# EasyEDA Pro project SCH_and_PCB.epro, board 主板4.0
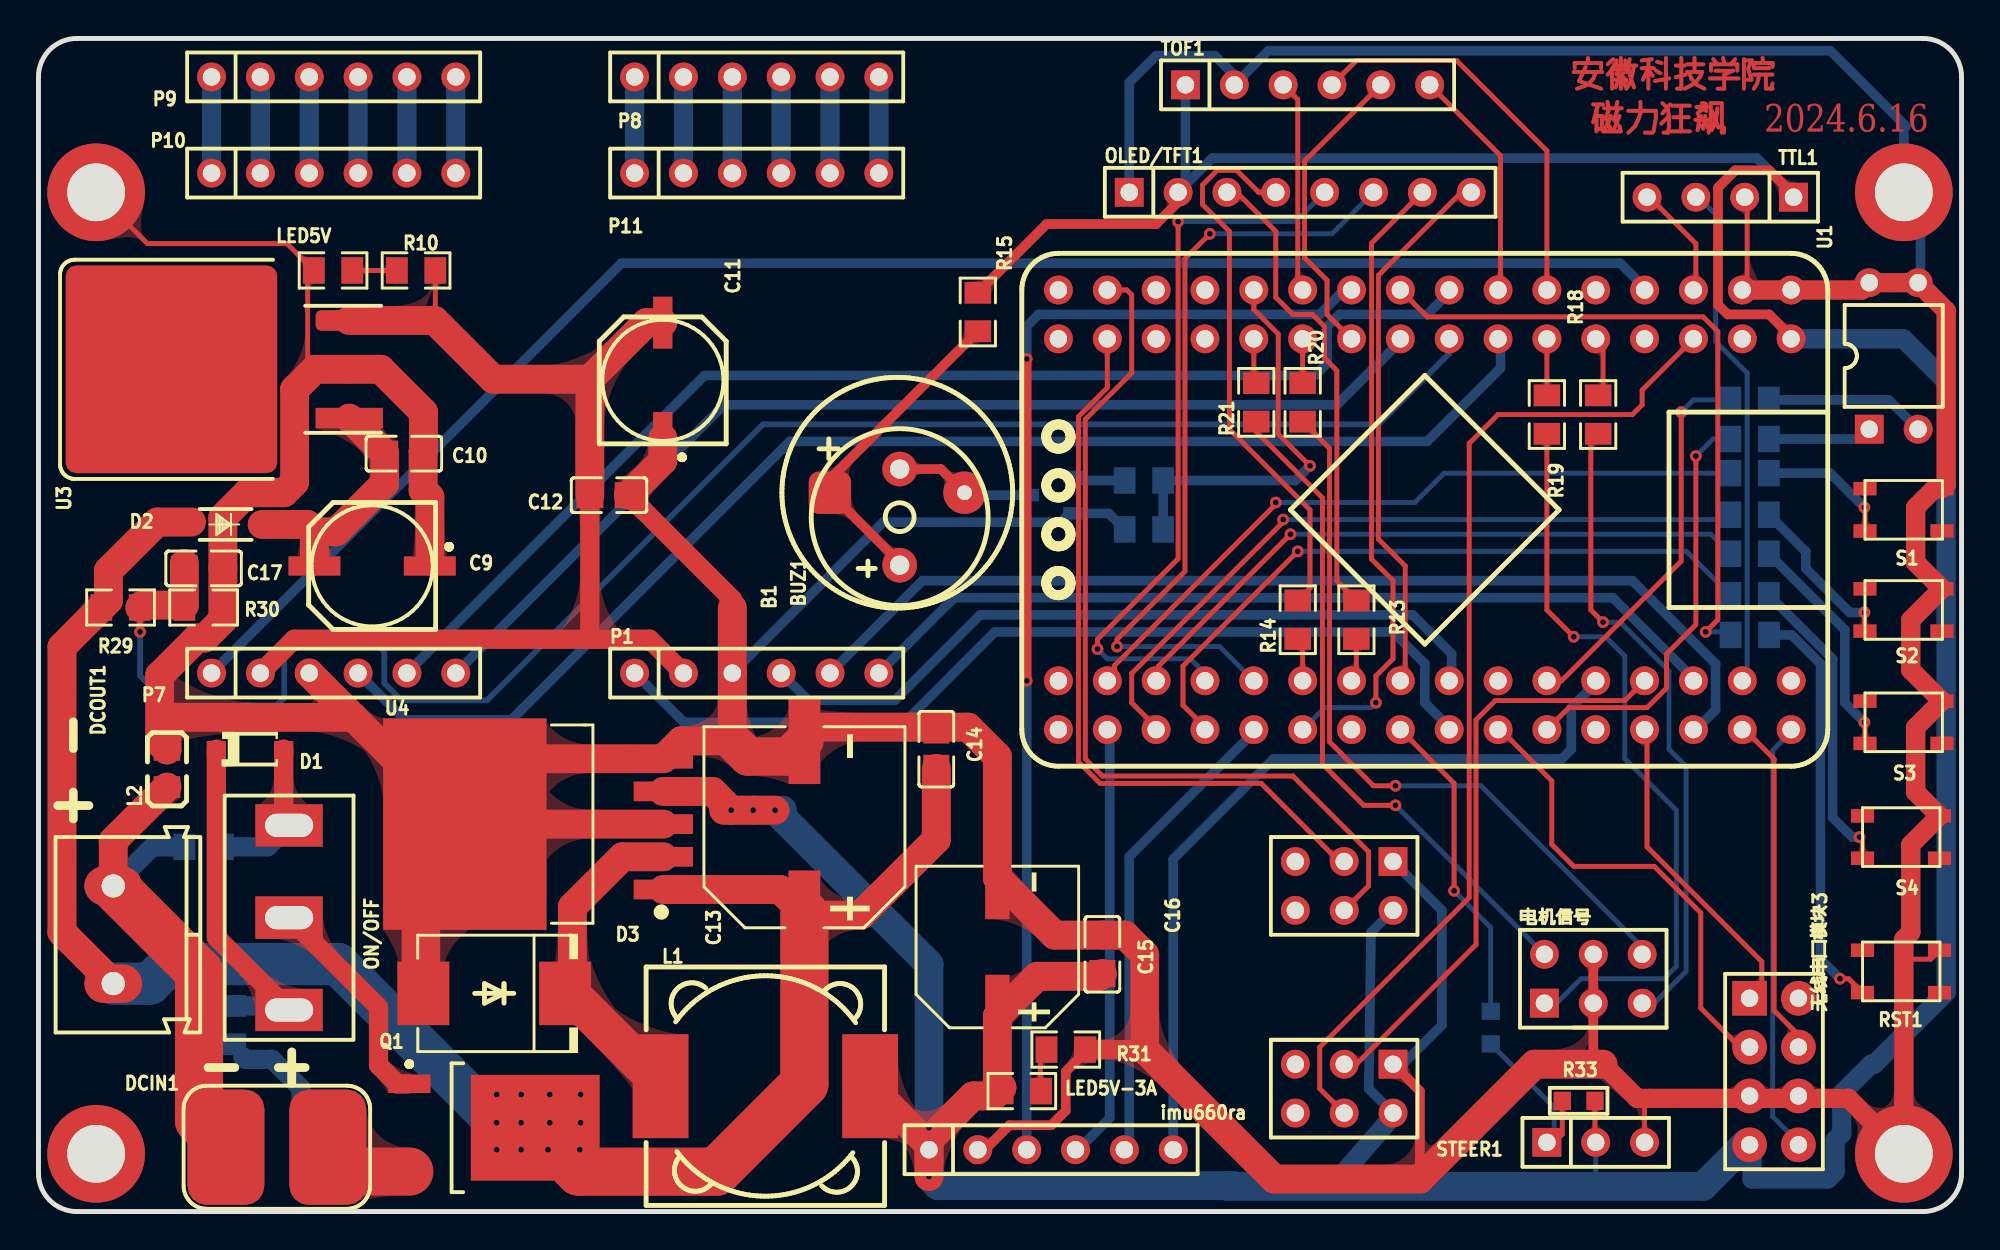
[diagram p10: board, top side]
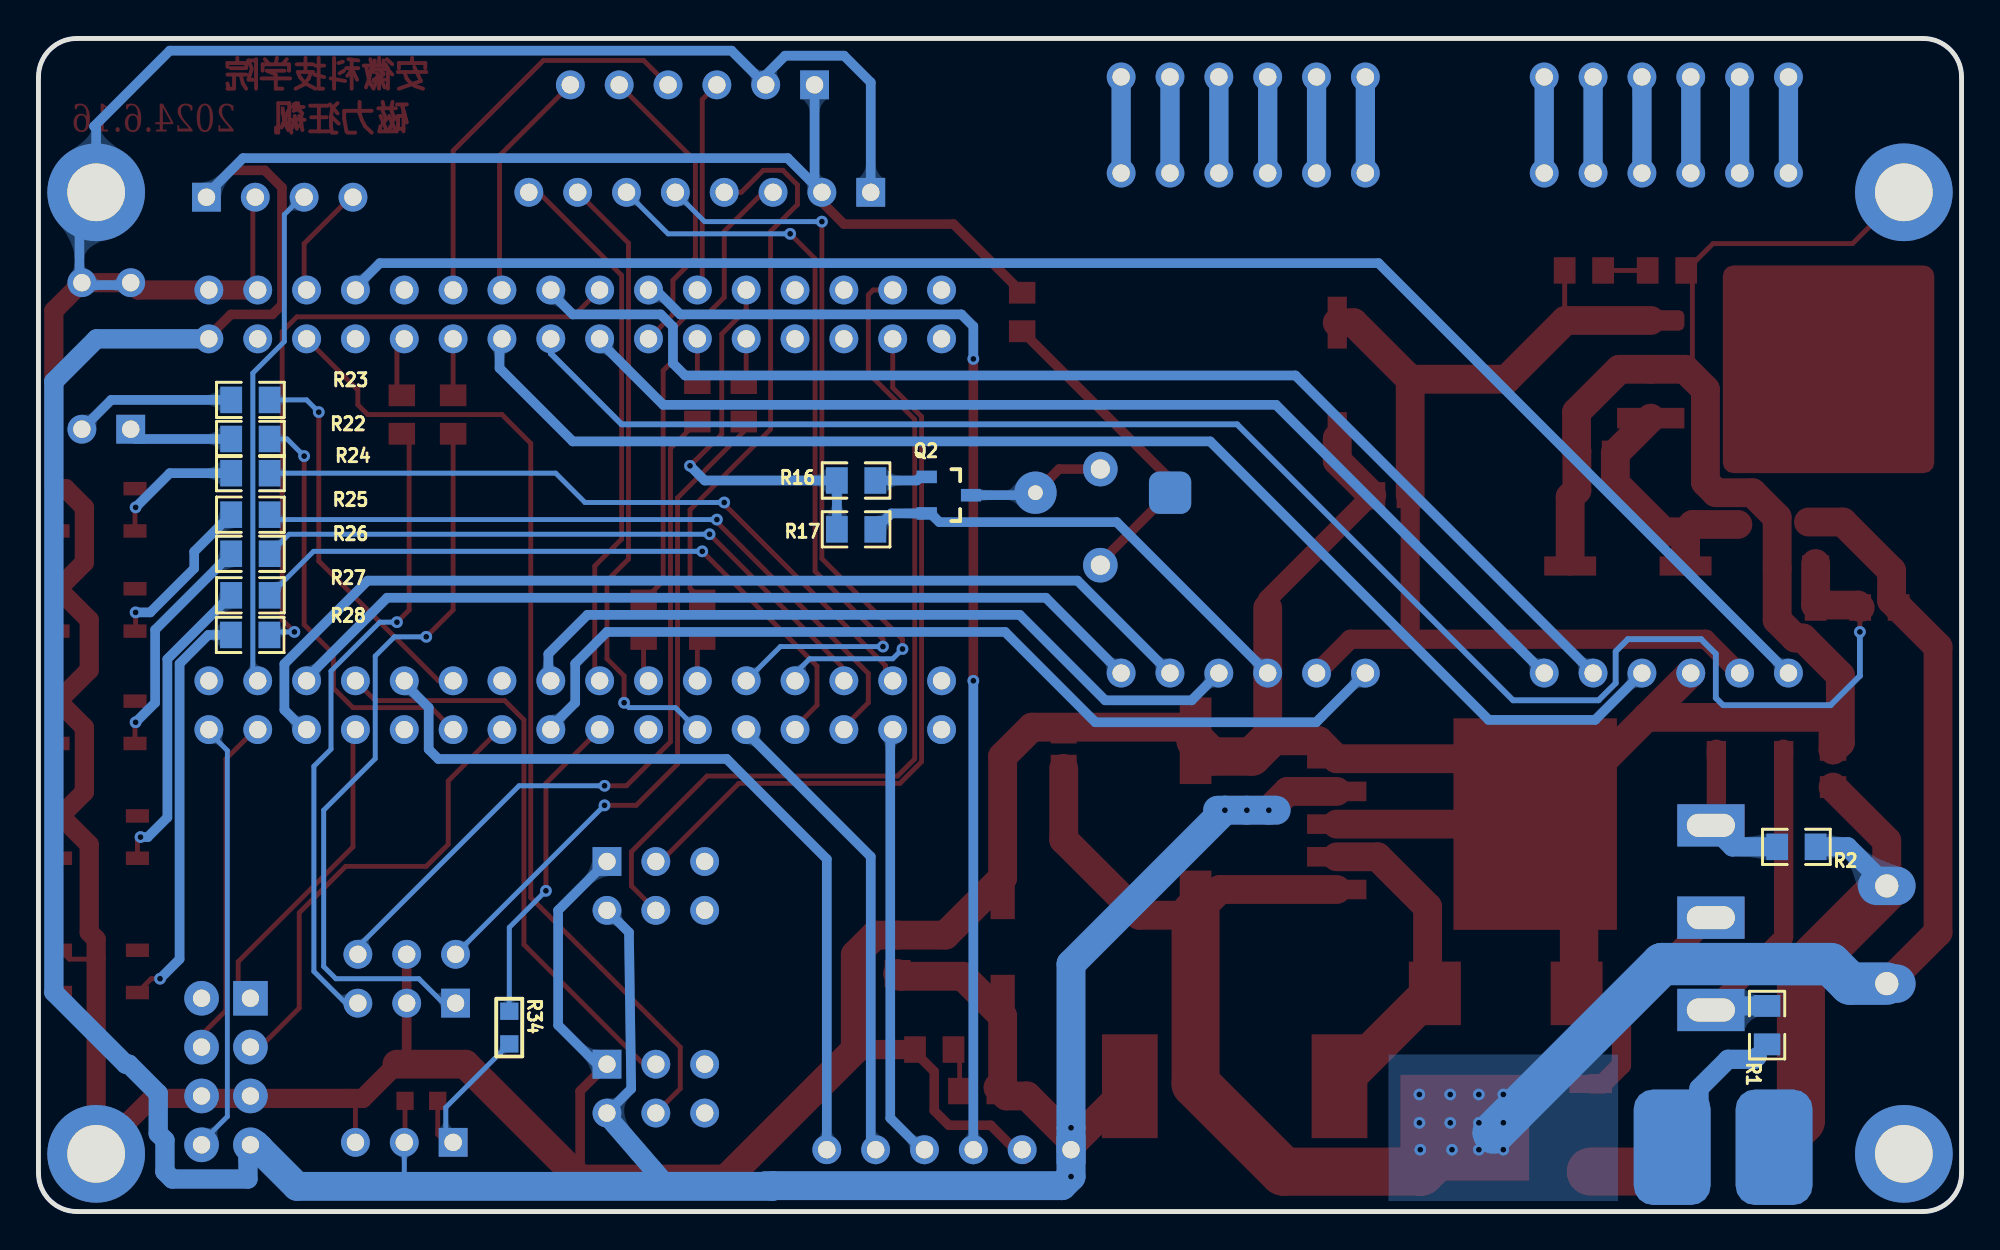
[diagram p11: board, bottom side, seen from below]

Outline 100 x 61 mm; copper layers: Top Layer, Bottom Layer. Coordinates in mm from the lower left corner of the outline.
Outline path: 0,59 0,2 arc(0.59,0.59) 2,0 98,0 arc(99.41,0.59) 100,2 100,59 arc(99.41,60.41) 98,61 2,61 arc(0.59,60.41) 0,59
Stack: Top Layer 0.035mm / Dielectric1 1.51mm FR4 er 4.5 / Bottom Layer 0.035mm

## Design rules (mm)
template: JLCPCB Capability(Two Layers Board)
spacing copperThickness1oz (default): track to track 0.102, other pairs 0.152 to 0.3
spacing copperThickness2oz: track to track 0.203, other pairs 0.152 to 0.3
track width copperThickness1oz (default): min 0.127, default 0.254, max 2.54
track width copperThickness2oz: min 0.203, default 0.254, max 2.54
differential pair differentialPair (default): width min 0.127, default 0.254, max 2.54; gap min 0.152, default 0.152
via viaSize (default): diameter min 0.5, default 0.61, max 10; hole min 0.3, default 0.305, max 6.3

## Placement (name value [footprint] x y rotation side)
B1  BEEP  [蜂鸣器-直插-无源蜂鸣器]  44.66 37.38 90 top
BUZ1  蜂鸣器  [BUZ-TH_BD9.0-P5.00-D0.6-FD]  44.78 36.11 90 top
C9  100uF  [CAPS6.3]  17.35 33.57 0 top
C10  100nF  [C0805]  19 39.41 0 top
C11  220uF  [CAPS6.3]  32.46 43.22 270 top
C12  100nF  [C0805]  29.67 37.25 0 top
C13  680uF  [CAP-SMD_BD10.0-L10.3-W10.3-LS10.9-FD]  39.83 19.98 90 top
C14  100nF  [C0805]  46.69 24.04 90 top
C15  100nF  [C0805]  55.32 13.38 90 top
C16  330uF  [CAP-SMD_BD8.0-L8.3-W8.3-LS9.9-FD]  49.86 13.76 90 top
C17  100nF  [C0805]  8.59 33.44 0 top
D1  BZT52C16  [SOD-123-L]  11 24.04 180 top
D2  SS54  [SOD-123]  9.73 35.73 0 top
D3  1N5823  [DO-214AB_L6.9-W5.9-LS7.9-RD]  23.7 11.34 180 top
DCIN1  T型插头  [WIRED T-HEADER THROUGHHOLE]  12.4 3.34 270 top
DCOUT1  DCOUT1  [KF/WJ/DG 301-2P-5.0MM]  3.89 14.39 270 top
imu660ra  Header 6  [HDR1X6]  46.31 3.22 0 top
L1  33uH  [IND-SMD_L12.3-W12.3]  37.8 6.52 0 top
L2  0  [L0805]  6.68 23.04 90 top
LED5V  GREEN  [LED0805]  15.32 48.94 180 top
LED5V-3A  GREEN  [LED0805]  51.13 6.26 0 top
NOREF  -  [Pad_e1]  3 3 0 top
NOREF#2  -  [Pad_e0]  3 53 0 top
NOREF#3  -  [Pad_e3]  97 3 0 top
NOREF#4  -  [Pad_e4]  97 53 0 top
OLED/TFT1  Header 8  [HDR1X8]  56.72 53 0 top
ON/OFF  SW-SPDT  [SS12D10]  13.03 15.28 90 top
P1  Header-D-M 1x6P  [HDR1X6-M]  31 28 0 top
P7  Header-D-M 1x6P  [HDR1X6-M]  9 28 0 top
P8  Header-D-M 1x6P  [HDR1X6-M]  31 59 0 top
P9  Header-D-M 1x6P  [HDR1X6-M]  9 59 0 top
P10  Header-D-M 1x6P  [HDR1X6-M]  9 54 0 top
P11  Header-D-M 1x6P  [HDR1X6-M]  31 54 0 top
Q1  HY19P03  [TO-252AA]  22.56 4.36 0 top
Q2  S8050  [SOT-23]  52.66 37.25 180 bottom
R1  4.7K  [R0805]  10.11 9.69 90 bottom
R2  1K  [R0805]  8.59 18.96 0 bottom
R10  4.7K  [R0805]  19.64 48.94 180 top
R13  100R  [R0805]  68.53 30.78 90 top
R14  100R  [R0805]  65.48 30.78 90 top
R15  10R  [R0805]  48.85 46.78 270 top
R16  4.7K  [R0805]  57.48 38.01 180 bottom
R17  10K  [R0805]  57.48 35.47 180 bottom
R18  100R  [R0805]  81.1 41.44 270 top
R19  100R  [R0805]  78.44 41.44 90 top
R20  100R  [R0805]  65.74 42.08 270 top
R21  100R  [R0805]  63.32 42.08 90 top
R22  470R  [R0805]  88.98 40.17 0 bottom
R23  470R  [R0805]  88.98 42.2 0 bottom
R24  470R  [R0805]  88.98 38.39 0 bottom
R25  470R  [R0805]  88.98 36.24 0 bottom
R26  470R  [R0805]  88.98 34.2 0 bottom
R27  470R  [R0805]  88.98 32.05 0 bottom
R28  470R  [R0805]  88.99 29.98 0 bottom
R29  200k  [R0805]  4.27 31.41 180 top
R30  20k  [R0805]  8.59 31.41 180 top
R31  4.7K  [R0805]  53.42 8.42 180 top
R33  10K  [RESC1608[0603]S-N]  80.09 5.76 0 top
R34  100R  [RESC1608[0603]S-N]  75.52 9.57 270 bottom
RST1  Button  [PTS810-3*4-CURVEPIN]  96.85 12.49 180 top
S1  Button  [PTS810-3*4-CURVEPIN]  96.98 36.49 180 top
S2  Button  [PTS810-3*4-CURVEPIN]  96.98 31.28 180 top
S3  Button  [PTS810-3*4-CURVEPIN]  96.98 25.44 180 top
S4  Button  [PTS810-3*4-CURVEPIN]  96.85 19.47 180 top
S5  SW DIP-2  [DIP4]  96.47 44.49 0 top
STEER1  Header 3  [HDR1X3]  78.44 3.6 0 top
TOF1  Header 6  [HDR1X6]  59.64 58.59 0 top
TTL1  Header 4  [HDR1X4]  91.26 52.75 180 top
U1  STC16F40K128_CoreBoard  [STC16F40K128_COREBOARD]  72.09 36.49 270 top
U3  SPX2940-5.0  [TO-263-3]  11.54 43.8 90 top
U4  LM2596S-5.0  [TO-263-5_L10.2-W8.9-P1.70-BR]  27.33 20.15 0 top
无线串口模块3  Header 4X2  [HDR4X2_A1]  88.98 11.09 270 top
电机信号  电机信号  [HDR2X3]  78.31 10.84 0 top
编码器1  编码器L  [HDR2X3]  70.44 18.2 180 top
编码器2  编码器R  [HDR2X3]  70.44 7.66 180 top

## Footprints (pads in the part's own frame, mm; a bottom-side part is the same pattern mirrored in y, then rotated)
BUZ-TH_BD9.0-P5.00-D0.6-FD
  round 1.8 hole 1: 1(-2.5,0) 2(2.5,0)
C0805
  rect 1.41x1.35 smd: 1(-1,0) 2(1,0)
CAP-SMD_BD8.0-L8.3-W8.3-LS9.9-FD
  rect 4.3x1.26 smd: 1(-3.596,0) 2(3.596,0)
CAP-SMD_BD10.0-L10.3-W10.3-LS10.9-FD
  rect 4.5x1.65 smd: 1(-4.5,0) 2(4.5,0)
CAPS6.3
  rect 2.7x1 smd: 1(-3,0) 2(3,0)
DIP4
  rect 1.5x1.5 hole 0.9x0.905: 1(-1.27,-3.81)
  round 1.5 hole 0.9x0.905: 2(1.27,-3.81) 3(1.27,3.81) 4(-1.27,3.81)
DO-214AB_L6.9-W5.9-LS7.9-RD
  rect 2.7x3.3 smd: 1(-3.687,0) 2(3.687,0)
HDR1X3
  rect 1.5x1.5 hole 0.905x0.9: 1(0,0)
  round 1.5 hole 0.905x0.9: 2(2.54,0) 3(5.08,0)
HDR1X4
  rect 1.5x1.5 hole 0.905x0.9: 1(0,0)
  round 1.5 hole 0.905x0.9: 2(2.54,0) 3(5.08,0) 4(7.62,0)
HDR1X6
  rect 1.5x1.5 hole 0.905x0.9: 1(0,0)
  round 1.5 hole 0.905x0.9: 2(2.54,0) 3(5.08,0) 4(7.62,0) 5(10.16,0) 6(12.7,0)
HDR1X6-M
  round 1.5 hole 0.905x0.9: 1(0,0) 2(2.54,0) 3(5.08,0) 4(7.62,0) 5(10.16,0) 6(12.7,0)
HDR1X8
  rect 1.5x1.5 hole 0.905x0.9: 1(0,0)
  round 1.5 hole 0.905x0.9: 2(2.54,0) 3(5.08,0) 4(7.62,0) 5(10.16,0) 6(12.7,0) 7(15.24,0) 8(17.78,0)
HDR2X3
  rect 1.5x1.5 hole 0.9: 1(0,0)
  round 1.5 hole 0.9: 2(0,2.54) 3(2.54,0) 4(2.54,2.54) 5(5.08,0) 6(5.08,2.54)
HDR4X2_A1
  rect 1.8x1.8 hole 0.9: 1(0,0)
  round 1.8 hole 0.9: 2(0,2.54) 3(2.54,0) 4(2.54,2.54) 5(5.08,0) 6(5.08,2.54) 7(7.62,0)
  round 1.8 hole 0.905x0.9: 8(7.62,2.54)
IND-SMD_L12.3-W12.3
  rect 2.9x5.4 smd: 1(-5.45,0) 2(5.45,0)
KF/WJ/DG 301-2P-5.0MM
  oval 2x3 hole 1.2x1.205: 1(2.54,0) 2(-2.54,0)
L0805
  rect 1.133x1.377 smd: 1(-0.966,0) 2(0.966,0)
LED0805
  rect 1.133x1.377 smd: A(-1,0) C(1,0)
Pad_e0
  round 5.08 hole 3: 1(0,0)
Pad_e1
  round 5.08 hole 3: 1(0,0)
Pad_e3
  round 5.08 hole 3: 1(0,0)
Pad_e4
  round 5.08 hole 3: 1(0,0)
PTS810-3*4-CURVEPIN
  rect 1.2x0.7 smd: 1(-2,-1.1) 2(2,1.1) 3(2,-1.1) 4(-2,1.1)
R0805
  rect 1.133x1.377 smd: 1(-1,0) 2(1,0)
RESC1608[0603]S-N
  rect 0.9x0.95 smd: 1(-0.85,0) 2(0.85,0)
SOD-123
  rect 1.2x0.85 smd: A(-1.9,0) K(1.9,0)
SOD-123-L
  rect 1x0.85 smd: A(-1.75,0) K(1.75,0)
SOT-23
  rect 1.05x0.65 smd: 1(-1.15,0.95) 2(-1.15,-0.95) 3(1.15,0)
SS12D10
  rect 2.2x3.5 hole 1.2x2.5: 1(-4.8,0) 2(0,0) 3(4.8,0)
STC16F40K128_COREBOARD
  round 1.5 hole 0.9: 1(-11.43,19.05) 2(-8.89,19.05) 3(-11.43,16.51) 5(-11.43,13.97) 6(-8.89,13.97) 8(-8.89,11.43) 10(-8.89,8.89) 12(-8.89,6.35) 17(-11.43,-1.27) 19(-11.43,-3.81) 22(-8.89,-6.35) 24(-8.89,-8.89) 27(-11.43,-13.97) 29(-11.43,-16.51) 30(-8.89,-16.51) 35(8.89,-16.51) 36(11.43,-16.51) 37(8.89,-13.97) 38(11.43,-13.97) 39(8.89,-11.43) 40(11.43,-11.43) 41(8.89,-8.89) 42(11.43,-8.89) 43(8.89,-6.35) 44(11.43,-6.35) 45(8.89,-3.81) 47(8.89,-1.27) 48(11.43,-1.27) 49(8.89,1.27) 50(11.43,1.27) 51(8.89,3.81) 52(11.43,3.81) 53(8.89,6.35) 54(11.43,6.35) 55(8.89,8.89) 56(11.43,8.89) 57(8.89,11.43) 58(11.43,11.43) 59(8.89,13.97) 60(11.43,13.97) 61(8.89,16.51) 62(11.43,16.51)
  round 1.5 hole 0.905x0.9: 4(-8.89,16.51) 7(-11.43,11.43) 9(-11.43,8.89) 11(-11.43,6.35) 13(-11.43,3.81) 14(-8.89,3.81) 15(-11.43,1.27) 16(-8.89,1.27) 18(-8.89,-1.27) 20(-8.89,-3.81) 21(-11.43,-6.35) 23(-11.43,-8.89) 25(-11.43,-11.43) 26(-8.89,-11.43) 28(-8.89,-13.97) 31(-11.43,-19.05) 32(-8.89,-19.05) 33(8.89,-19.05) 34(11.43,-19.05) 46(11.43,-3.81) 63(8.89,19.05) 64(11.43,19.05)
TO-252AA
  rect 6.7x5.5 smd: 1(3.275,0)
  rect 2.2x0.95 smd: 2(-3.275,2.28) 3(-3.275,-2.28)
TO-263-3
  rect 1.07x3.5 smd: 1(-2.54,-4.623)
  custom 1.07x3.5 smd: 2(0,-4.623) 3(2.54,-4.623)
  custom 10.8x11 smd: 4(0,4.623)
TO-263-5_L10.2-W8.9-P1.70-BR
  rect 3.083x1.02 smd: 1(5.16,-3.4) 2(5.16,-1.7) 3(5.16,0) 4(5.16,1.7) 5(5.16,3.4)
  rect 8.5x11 smd: 6(-5.16,0)
WIRED T-HEADER THROUGHHOLE
  custom 6x4 hole 2.605x2.6: 1(0,2.65) 2(0,-2.65)
蜂鸣器-直插-无源蜂鸣器
  custom 2.2x2.2 hole 0.767x0.762: 1(0,3.5)
  round 2.2 hole 0.767x0.762: 2(0,-3.5)

## Nets
As in the schematic, except:
GND: C9.2 C10.2 C11.2 C12.2 C13.2 C14.2 C15.2 C16.2 C17.2 D3.2 imu660ra.2 L2.2 LED5V.C NOREF#2.1 NOREF#3.1 NOREF#4.1 OLED/TFT1.1 P1.3 P7.3 Q2.2 R17.2 R30.1 R31.1 RST1.1 S1.1 S2.1 S3.1 S4.1 S5.3 S5.4 STEER1.3 TOF1.2 TTL1.2 U1.1 U1.3 U3.2 U4.3 U4.5 U4.6 无线串口模块3.5 无线串口模块3.6 电机信号.3 电机信号.4 编码器1.1 编码器2.1

Pads without a net: NOREF 1; RST1 3 4; S1 3 4; S2 3 4; S3 3 4; S4 3 4; U1 4 8 9 25 26 27 28 31 32 33 34 46 51 63; U3 4; 无线串口模块3 2; 编码器1 5 6; 编码器2 5 6

## Via types
v1: diameter 0.61, hole 0.305, Top Layer to Bottom Layer, 43 vias

## Routing (per net, layer and track width the routed paths; a pad name or vN(x,y) marks a point on that pad's centre or on a via; arc(x,y) is an arc through that point)
+5V: length 250.3
  Top Layer w0.254: 80.94,6.01 80.94,4.02 81.36,3.6
  Top Layer w0.5: 91.39,52.75 90,54.14 88.23,54.14 87.34,53.25 87.34,47.15 87.84,46.65 90,46.65 91.26,45.38 ; R15.1 52.42,51.35 58.12,51.35 59.26,52.49 OLED/TFT1.2
  Top Layer w1.5: L1.2 46.31,3.46 ; 46.31,3.46 v1(46.31,1.82) ; 46.31,3.46 46.31,3.72 48.59,6.01 49.66,6.01 50.1,6.45 49.86,6.68 C16.1 51.94,12.23 55.18,12.23 C15.1 ; v1(36.02,20.87) v1(37.16,20.87) v1(38.31,20.87) ; v1(36.02,20.87) 35.64,20.87 ; v1(36.02,20.87) 35.04,21.85 U4.4
  Bottom Layer w0.254: STEER1.2 80.98,1.56
  Bottom Layer w0.5: 91.39,52.75 89.36,54.78 61.04,54.78 59.64,53.38 ; 编码器1.2 69.29,14.52 69.18,6.38 编码器2.2 ; 59.64,53.38 OLED/TFT1.2 ; 59.64,53.38 TOF1.1
  Bottom Layer w1: 62.18,1.35 67.3,1.35 70.56,5.12 ; 88.34,3.47 89.11,2.71 89.11,1.69 93.04,1.69 93.42,2.07 93.42,3.71 93.77,4.06 93.77,6.14 95.3,7.66 95.46,7.66 99.2,11.41 99.2,43.16 96.98,45.38 91.26,45.38
  Bottom Layer w1.5: v1(38.31,20.87) 38.69,20.87 ; v1(38.31,20.87) v1(37.16,20.87) v1(36.02,20.87) 35.64,20.87 ; v1(38.31,20.87) 46.31,12.87 v1(46.31,4.35) imu660ra.1 v1(46.31,1.82) 46.78,1.35 61.8,1.35 ; 61.8,1.35 61.84,1.31 86.56,1.31 88.72,3.47 无线串口模块3.7 ; 61.8,1.35 62.18,1.35
GND: length 409.3
  Top Layer w0.254: 83.82,5.88 83.52,5.58 83.52,3.98 83.9,3.6 ; 96.73,13.12 98.39,13.12 98.85,13.59 ; NOREF#2.1 5.67,50.33 12.92,50.33 LED5V.C 14,48.61 14,43.42 ; 88.72,47.92 88.85,48.05 88.85,52.75
  Top Layer w0.5: R31.1 54.42,8.28 53.42,7.28 53.42,5.25 52.66,4.49 50.48,4.49 48.7,2.71 ; 71.83,1.44 71.83,6.26 编码器2.1 ; 80.85,13.76 电机信号.3 80.85,8.17 81.36,7.66
  Top Layer w1: 88.72,47.92 94.82,47.92 S5.4 S5.3 ; 81.36,7.66 83.14,5.88 94.12,5.88 NOREF#3.1 97,14.16 97.36,14.52 97.36,19.08 S4.1 97.62,21.81 97.62,25.18 S3.1 97.36,28.16 97.36,30.76 S2.1 97.62,33.75 97.62,36.62 98.59,37.59 S1.1 99.2,37.81 99.2,46.84 97.87,48.17 ; 36.08,31.39 36.08,31.84 C12.2 ; R31.1 57.52,8.42
  Top Layer w1.5: U4.3 U4.6 21.93,20.15 16.39,25.69 ; P7.3 16.39,25.69 ; 16.39,25.69 6.68,25.69 L2.2 6.3,24.38 6.3,27.88 8.25,29.82 8.65,29.82 9.59,30.76 C17.2 9.59,36.09 10.87,37.38 12.76,37.38 13.32,37.93 13.32,42.74 14.37,43.8 U3.2 17.79,43.8 20.02,41.57 20.02,39.55 20,39.54 20,37.51 20.35,37.16 20.35,33.82 ; 36.08,31.39 P1.3 36.08,24.48 33.43,24.48 U4.5 23.03,23.55 22.17,22.69 ; C12.2 32.46,39.05 C11.2 ; 81.36,7.66 77.8,7.66 71.83,1.69 64.25,1.69 57.52,8.42 57.52,13.35 56.5,14.38 C15.2 52.84,14.38 C16.2 49.86,23.66 48.34,25.19 40.54,25.19 C13.2
  Top Layer w2: C13.2 39.01,23.66 36.9,23.66 36.08,24.48 ; 19.89,11.72 19.89,17.86 U4.6
  Bottom Layer w0.5: 编码器1.1 72.98,15.66 72.98,9.69 70.94,7.66 编码器2.1 ; P1.3 43.93,35.85 53.16,35.85 53.61,36.3 Q2.2 55.66,36.3 R17.2 ; OLED/TFT1.1 56.72,58.72 58.11,60.1 61.17,60.1 62.18,59.1 TOF1.2 63.96,60.37 93.17,60.37 97.11,56.43 97,56.32 NOREF#4.1 97.87,52.13 97.87,48.17 95.33,48.17
GND_BAT: length 26.9
  Top Layer w1.5: DCOUT1.2 3.89,19.28 L2.1
  Top Layer w2.5: DCIN1.2 8.35,4.74 8.35,12.47 DCOUT1.2
  Bottom Layer w1: DCOUT1.2 5.92,18.96 R2.1
VCC_5V: length 57.9
  Top Layer w0.254: R10.1 20.64,46.9
  Top Layer w1: P1.2 31.78,29.76 28.94,29.76 ; 28.94,29.76 13.3,29.76 P7.2 ; 28.94,29.76 28.67,30.02 C12.1
  Top Layer w1.5: U3.3 20.6,46.34 23.66,43.28 28.67,43.28 ; 28.67,43.28 C12.1 ; 28.67,43.28 31.61,46.22 C11.1
VCC_BAT: length 99.2
  Top Layer w1.5: 7.96,35.86 6.17,35.86 3.64,33.32 3.64,31.78 R29.2 1.22,29.36 1.22,14.52 DCOUT1.1 ; U4.1 38.56,16.75 C13.1 39.9,15.41 42.75,15.41 46.69,19.34 C14.1
  Top Layer w2.5: 25.83,4.36 28.12,2.07 35.26,2.07 39.83,6.64 C13.1
  Bottom Layer w2.2: 24.34,4.1 v1(23.83,4.62) 15.57,12.87 6.81,12.87 5.79,11.85 DCOUT1.1
  vias: v1(23.83,6.09) v1(23.83,3.22) v1(25.1,6.09) v1(25.1,4.61) v1(25.1,3.22) v1(26.5,3.22) v1(26.59,6.09) v1(26.59,4.61) v1(28.15,3.22) v1(28.19,6.09) v1(28.19,4.61)
0.0: length 48.8
  Bottom Layer w0.5: 73.49,25.06 72.09,26.46 72.09,28.49 70.44,30.14 49.74,30.14 45.04,25.44 33.56,25.44 P1.1
0.1: length 39.5
  Bottom Layer w0.5: P1.4 40.04,26.58 44.53,26.58 48.97,31.03 71.45,31.03 73.49,29 73.49,27.6
0.2: length 25.3
  Top Layer w0.254: 76.03,25.06 78.69,22.39 78.69,19.09 79.84,17.95 84.03,17.95 86.44,15.53 86.44,10.58 88.47,8.55 89.61,8.55
0.3: length 16.4
  Top Layer w0.254: 89.61,11.09 89.61,13 83.65,18.96 83.65,25.06
0.4: length 30.3
  Top Layer w0.254: U1.57 82.49,26.57 75.76,26.57 74.75,25.57 74.75,13.88 68.41,7.53
0.5: length 53.7
  Bottom Layer w0.5: 86.19,25.06 87.21,26.09 87.21,28.48 82.88,32.81 45.97,32.81 P1.5
0.6: length 45.9
  Bottom Layer w0.5: P1.6 47.62,31.92 81.87,31.92 86.19,27.6
0.7: length 17.9
  Top Layer w0.254: 92.15,8.55 90.25,10.45 90.25,23.53 88.72,25.06
1.0: length 26.3
  Bottom Layer w0.254: 88.72,27.6 88.85,27.73 88.85,43.6 87.21,45.24 87.21,51.84 86.31,52.75
1.1: length 5.8
  Top Layer w0.254: 86.19,47.92 86.19,50.33 83.77,52.75
1.3: length 84.1
  Bottom Layer w0.5: P7.1 30.32,49.32 82.25,49.32 83.65,47.92
1.4: length 69.5
  Bottom Layer w0.5: 76.03,45.38 76.03,43.86 72.22,40.05 39.07,40.05 24.59,25.57 19.05,25.57 P7.4
1.5: length 90.1
  Top Layer w0.254: v1(5.29,30.14) 5.29,31.39 R29.1
  Top Layer w1.5: 7.59,33.7 7.59,31.54 5.4,31.54 R29.1
  Bottom Layer w0.3: U1.16 73.36,44.62 69.68,40.94 37.67,40.94 23.32,26.58 18.88,26.58 17.99,27.47 17.99,29.12 17.35,29.76 13.54,29.76 12.78,29 12.78,26.71 12.4,26.33 6.81,26.33 5.29,27.85 v1(5.29,30.14)
1.6: length 63.7
  Bottom Layer w0.5: P7.5 34.63,43.47 66.37,43.47 67.01,44.11 67.01,46.02 67.64,46.65 72.22,46.65 73.49,47.92
1.7: length 56.4
  Bottom Layer w0.5: P7.6 35.65,41.95 67.52,41.95 70.94,45.38
2.0: length 38.7
  Top Layer w0.254: v1(55.07,29.25) 55.07,29.76 59.26,33.95 v1(59.26,51.48)
  Bottom Layer w0.254: v1(59.26,51.48) 65.36,51.48 OLED/TFT1.5 ; v1(55.07,29.25) 55.58,28.74 59.9,28.74 60.66,27.98 U1.39
2.1: length 40.7
  Top Layer w0.254: v1(60.91,50.84) 59.62,49.55 59.62,33.29 56.09,29.76 v1(56.09,29.38)
  Bottom Layer w0.254: OLED/TFT1.6 67.26,50.84 v1(60.91,50.84) ; v1(56.09,29.38) 61.42,29.38 U1.41
2.2: length 32.9
  Top Layer w0.254: OLED/TFT1.7 69.32,50.36 69.32,33.92 70.44,32.81 70.44,28.74 69.55,27.85 v1(69.55,26.46)
  Bottom Layer w0.254: v1(69.55,26.46) 69.29,26.2 66.88,26.2 U1.44
2.3: length 2.3
  Top Layer w0.254: U1.43 65.74,29.52 R14.1
2.5: length 2.3
  Top Layer w0.254: U1.45 68.53,27.85 R13.1
2.6: length 16.6
  Top Layer w0.254: v1(73.61,16.68) 73.61,22.27 U1.48
  Bottom Layer w0.254: R34.1 75.52,14.77 v1(73.61,16.68)
2.7: length 28.4
  Top Layer w0.254: OLED/TFT1.8 73.99,53 69.68,48.68 69.68,34.97 71.07,33.57 71.07,27.85 U1.47
3.4: length 38.5
  Top Layer w0.254: U1.30 55.58,42.84 54.08,41.34 54.08,23.39 55.2,22.27 63.58,22.27 67.77,18.08
3.5: length 46.8
  Top Layer w0.254: 67.9,15.66 69.17,16.93 69.17,18.71 65.23,22.65 55.32,22.65 54.44,23.54 54.44,41.19 56.85,43.6 56.85,47.67 56.59,47.92 U1.29
4.0: length 61.1
  Top Layer w0.5: v1(51.39,27.6) v1(51.39,44.33)
  Bottom Layer w0.5: v1(51.39,44.33) 51.39,46.03 52,46.65 66.63,46.65 67.9,47.92 68.41,47.92 ; v1(51.39,27.6) 51.39,2.71
4.1: length 23.1
  Bottom Layer w0.5: 53.93,2.71 53.93,3.08 55.71,4.86 55.71,25.06
4.2: length 25.2
  Bottom Layer w0.5: 56.47,2.71 56.72,2.96 56.72,18.46 63.32,25.06
4.3: length 42.3
  Bottom Layer w0.5: 59.01,3.22 59.01,18.33 64.21,23.54 79.21,23.54 79.71,24.04 79.71,26.2 81.1,27.6
4.4: length 12.2
  Top Layer w0.254: TOF1.6 76.03,54.91 76.03,47.92
4.5: length 22.6
  Bottom Layer w0.254: 91.26,25.06 90.18,23.97 90.18,4.94 91.65,3.47
4.7: length 15.9
  Top Layer w0.254: TOF1.5 65.84,54.63 65.84,49.6 67.01,48.43 67.01,46.65 U1.20
5.3: length 52.9
  Top Layer w0.254: 67.9,5.12 66.63,6.39 66.63,8.55 74.4,16.32 74.4,39.94 75.9,41.44 82.88,41.44 83.39,41.95 83.39,42.71 U1.6
6.0: length 3.2
  Top Layer w0.254: 81.36,42.32 81.36,45 U1.10
6.2: length 2.9
  Top Layer w0.254: U1.12 R19.2
6.3: length 20.9
  Top Layer w0.254: TOF1.4 68.53,59.86 73.74,59.86 78.44,55.16 U1.11
6.4: length 2.3
  Top Layer w0.254: U1.22 R20.1
6.5: length 11.1
  Top Layer w0.254: TOF1.3 65.48,57.83 65.48,48.3 65.87,47.92
6.6: length 2.4
  Top Layer w0.254: R21.2 63.2,43.2 U1.24
6.7: length 20.8
  Top Layer w0.254: v1(66.12,38.78) 64.47,40.43 64.47,45.63 63.2,46.9 U1.23
  Bottom Layer w0.5: R17.1 R16.1 65.36,38.01 v1(66.12,38.78)
7.0: length 37.1
  Top Layer w0.254: v1(64.34,36.87) 64.34,36.78 55.96,28.4 55.96,27.85 55.71,27.6
  Bottom Layer w0.254: R24.1 73.1,38.39 71.58,36.87 v1(64.34,36.87)
7.1: length 38.1
  Top Layer w0.254: 58.25,25.06 56.85,26.46 56.85,27.98 64.72,35.86 v1(64.72,35.98)
  Bottom Layer w0.254: v1(64.72,35.98) 87.72,35.98 R25.1
7.2: length 33.8
  Top Layer w0.254: 58.25,27.6 58.25,28.36 v1(65.1,35.22)
  Bottom Layer w0.254: R26.1 86.96,35.22 v1(65.1,35.22)
7.3: length 35.7
  Top Layer w0.254: 60.78,25.06 59.51,26.33 59.51,28.36 v1(65.48,34.33)
  Bottom Layer w0.254: R27.1 85.69,34.33 v1(65.48,34.33)
7.5: length 22
  Top Layer w0.254: v1(86.19,39.28) 86.19,30.52 84.66,29 84.66,27.22 83.65,26.2 79.58,26.2 U1.54
  Bottom Layer w0.254: v1(86.19,39.28) 87.07,40.17 R22.1
7.6: length 20.1
  Top Layer w0.254: v1(85.42,41.57) 85.42,33.82 79.2,27.6 U1.53
  Bottom Layer w0.254: R23.1 86.06,42.2 v1(85.42,41.57)
RST: length 34.6
  Top Layer w0.254: U1.17 72.22,46.52 86.57,46.52 87.33,45.76 87.33,30.78 v1(86.69,30.14)
  Bottom Layer w0.254: R28.1 87.83,30.14 v1(86.69,30.14)
$1N828: length 13.3
  Top Layer w1.5: U3.1 18,39.42 18,37.86 15.49,35.35 14.35,35.35 ; 14.35,33.82 14.35,35.35 ; 14.35,35.35 13.97,35.73 D2.K
$1N831: length 2.3
  Top Layer w0.254: LED5V.A R10.2
$1N927: length 24.9
  Top Layer w0.254: R13.2 67.52,32.79 67.52,43.73 66.88,44.36 66.88,46.02 66.25,46.65 65.23,46.65 64.34,47.54 64.34,50.97 62.31,53 61.8,53
$1N930: length 28.8
  Top Layer w0.254: OLED/TFT1.4 63.45,53 62.31,54.14 61.29,54.14 60.53,53.38 60.53,52.36 61.93,50.97 61.93,40.68 66.12,36.49 66.12,32.41 R14.2
$1N1043: length 2.8
  Bottom Layer w0.5: R16.2 54.32,38.01 54.14,38.2 Q2.1
$1N1188: length 38.6
  Top Layer w0.254: v1(70.56,22.14) 69.42,22.14 67.13,24.42 67.13,39.68 R20.2
  Bottom Layer w0.254: 83.9,13.25 75.01,22.14 v1(70.56,22.14)
$1N1189: length 35.4
  Top Layer w0.254: v1(70.56,21.12) 68.91,21.12 66.77,23.27 66.77,37.11 63.32,40.55 R21.1
  Bottom Layer w0.254: 78.82,13.25 78.44,13.25 v1(70.56,21.12)
$1N1190: length 33.2
  Top Layer w0.254: R18.2 80.72,40.06 80.72,31.28 v1(81.36,30.65)
  Bottom Layer w0.254: v1(81.36,30.65) 82.25,30.65 84.79,28.11 84.79,24.04 85.68,23.16 85.68,12.49 83.9,10.71
$1N1191: length 38.6
  Top Layer w0.254: v1(79.84,29.89) 78.44,31.28 R19.1
  Bottom Layer w0.254: v1(79.84,29.89) 81.49,29.89 82.49,28.88 82.49,23.55 85.17,20.87 85.17,12.74 84.53,12.11 80.22,12.11 78.82,10.71
$1N1401: length 14.5
  Top Layer w2.5: Q1.3 15.55,2.08 15.05,2.58 DCIN1.1
  Bottom Layer w0.254: 13.65,3.98 14.65,2.98 14.65,1.21
  Bottom Layer w1: 13.65,3.98 13.65,6.41 12.14,7.92 10.76,7.92 10.62,8.06
$1N1404: length 18
  Top Layer w1: 13.03,10.48 9.25,14.26 D1.K
  Bottom Layer w1: 13.03,10.48 12.82,10.69 10.24,10.69
$1N1405: length 8
  Top Layer w1: ON/OFF.3 12.75,20.36 D1.A
  Bottom Layer w1: R2.2 11.92,18.96 ON/OFF.3
$1N1408: length 11.6
  Top Layer w1: Q1.2 18.66,6.64 17.68,7.61 17.68,10.63 ON/OFF.2
$1N1624: length 5.5
  Bottom Layer w0.5: 95.33,40.55 94.95,40.17 R22.2
$1N1625: length 8.6
  Bottom Layer w0.5: 97.87,40.55 96.22,42.2 R23.2
$1N1628: length 6.9
  Top Layer w0.254: S1.2 94.98,36.58 v1(94.95,36.62)
  Bottom Layer w0.5: R24.2 93.17,38.39 v1(94.95,36.62)
$1N1629: length 8.6
  Top Layer w0.254: v1(94.95,31.16) 94.95,30.22 S2.2
  Bottom Layer w0.5: v1(94.95,31.16) 94.19,31.16 91.9,33.44 91.9,34.31 R25.2
$1N1630: length 12
  Top Layer w0.254: 94.98,24.34 94.98,25.41 v1(94.95,25.44)
  Bottom Layer w0.5: 94.98,25.41 93.93,26.46 93.93,30.25 R26.2
$1N1631: length 15.9
  Top Layer w0.254: S4.2 94.85,19.31 v1(94.69,19.47)
  Bottom Layer w0.5: R27.2 93.3,28.73 93.3,20.49 94.31,19.47 v1(94.69,19.47)
$1N1632: length 21.6
  Top Layer w0.254: RST1.2 94.13,12.11 v1(93.68,12.11)
  Bottom Layer w0.5: v1(93.68,12.11) 92.66,13.12 92.66,28.49 91.17,29.98 R28.2
$1N8370: length 5
  Bottom Layer w1: P10.1 P9.1
$1N8373: length 5
  Bottom Layer w1: P10.2 P9.2
$1N8376: length 5
  Bottom Layer w1: P10.3 P9.3
$1N8379: length 5
  Bottom Layer w1: P10.4 P9.4
$1N8382: length 5
  Bottom Layer w1: P10.5 P9.5
$1N8385: length 5
  Bottom Layer w1: P10.6 P9.6
$1N8391: length 5
  Bottom Layer w1: P8.1 P11.1
$1N8394: length 5
  Bottom Layer w1: P8.2 P11.2
$1N8397: length 5
  Bottom Layer w1: P8.3 P11.3
$1N8400: length 5
  Bottom Layer w1: P8.4 P11.4
$1N8403: length 5
  Bottom Layer w1: P8.5 P11.5
$1N8406: length 5
  Bottom Layer w1: P8.6 P11.6
$1N13953: length 17.4
  Top Layer w1.5: 27.26,11.72 27.77,12.23 27.77,15.84 30.37,18.45 U4.2
  Top Layer w2: L1.1 32.35,6.64 27.26,11.72
$1N14454: length 2.4
  Top Layer w0.254: 52.42,8.68 52.1,8.36 52.1,6.45
$1N16658: length 9.1
  Top Layer w0.254: 79.24,6.01 79.24,4.02 78.82,3.6
  Bottom Layer w0.254: R34.2 78.82,5.41 78.82,3.6
$1N16761: length 17.1
  Top Layer w0.5: R15.2 40.65,37.58 40.65,37.38 ; B1.1 44.78,33.75 BUZ1.1
$1N16768: length 7.8
  Top Layer w0.5: B1.2 46.93,38.61 BUZ1.2
  Bottom Layer w0.5: Q2.3 47.78,37.25 47.65,37.38

## Copper pours and planes (outline as drawn; the poured copper is in the pictures)
VCC_BAT on Bottom Layer: 17.86,8.17 29.8,8.17 29.8,0.55 17.86,0.55

Small or netless copper shapes (teardrops, artwork), in the pictures only: 197 on Top Layer, 140 on Bottom Layer

## Text on the board
Top Layer: 安徽科技学院 | 磁力狂飙 | 2024.6.16
Top Solder Mask Layer: 安徽科技学院 | 磁力狂飙 | 2024.6.16
Top Silkscreen Layer: - +
